# EAGLE design Attiny MCU Module (EAGLE 9.0.0)
Pinboard II CPU Module Atmel Attiny xx
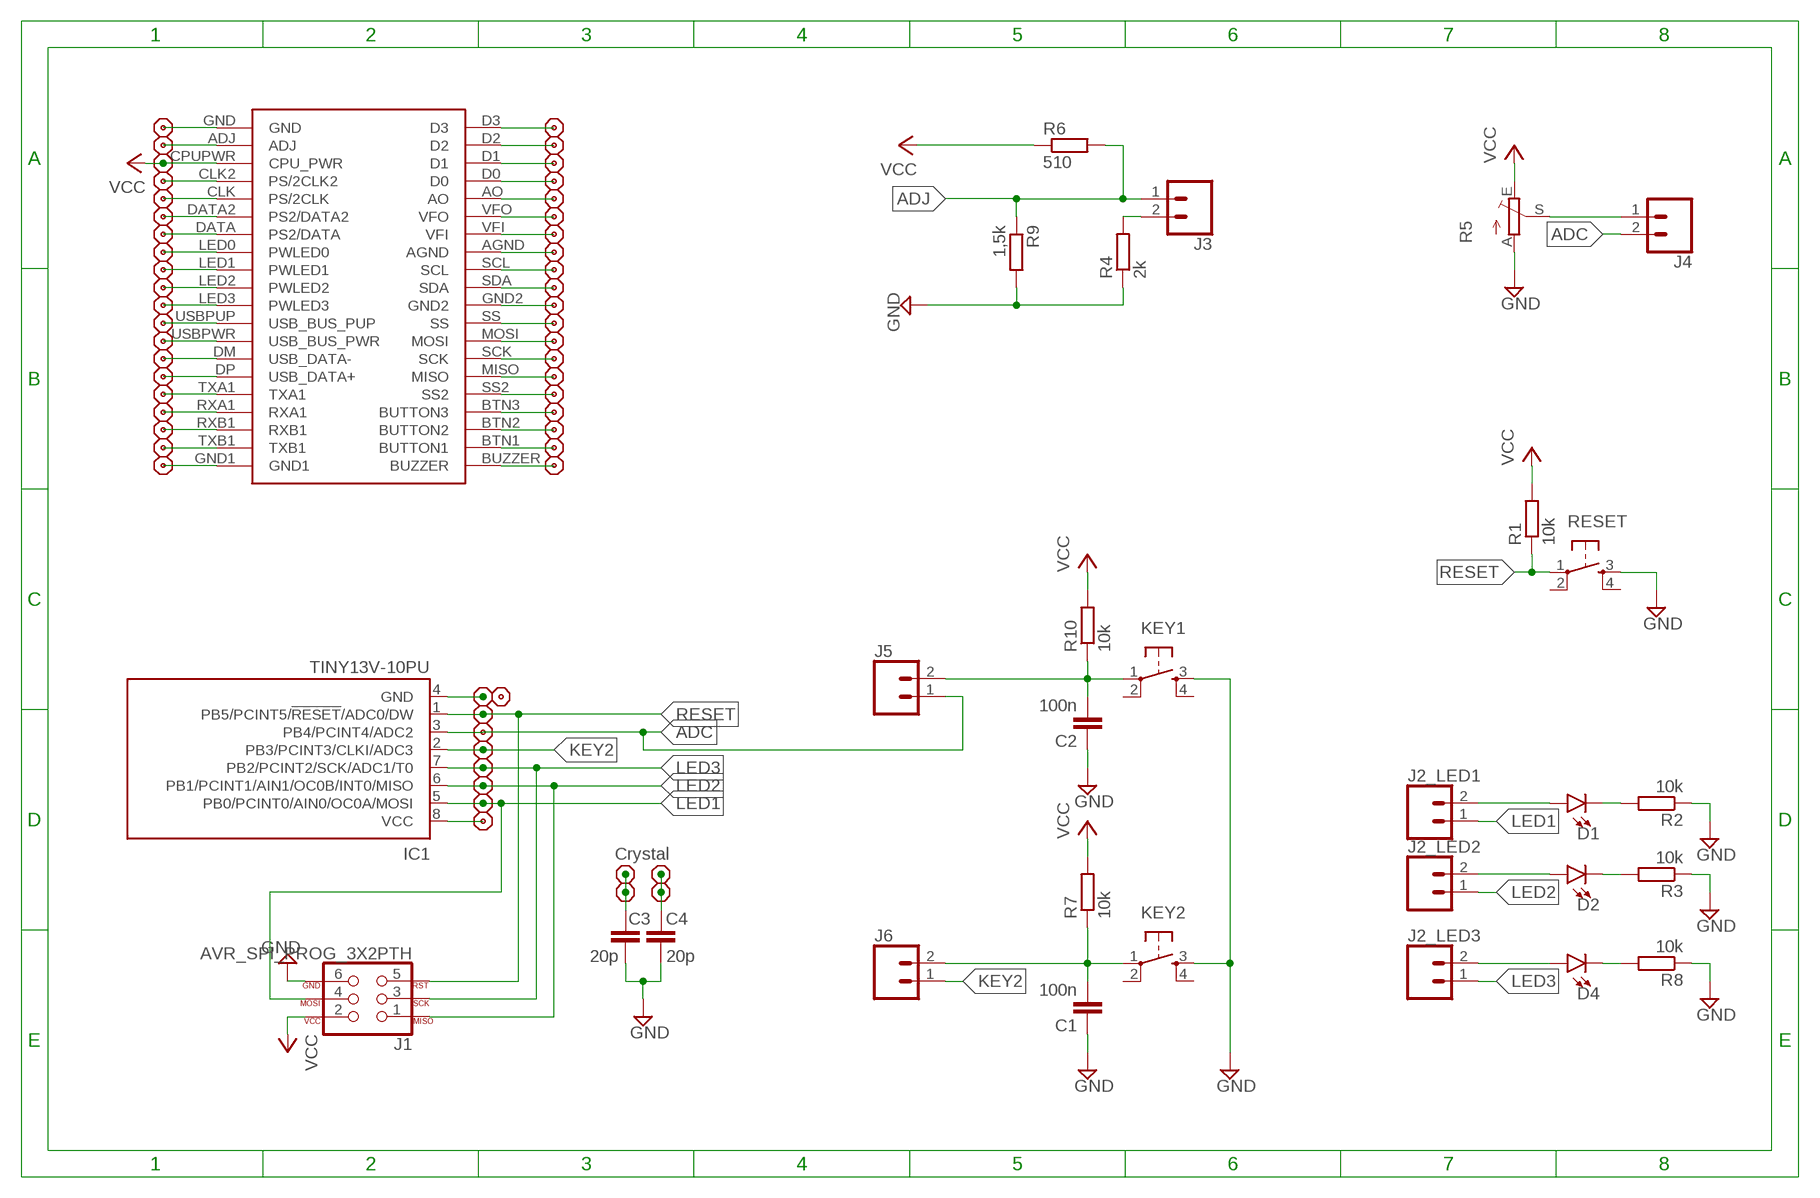
[diagram p0: schematic, sheet 1]

## Parts
C1  100n  C-EUC1206  [C1206]
C2  100n  C-EUC1206  [C1206]
C3  20p  C-EUC1206  [C1206]
C4  20p  C-EUC1206  [C1206]
D1  LED1206  [LED-1206]
D2  LED1206  [LED-1206]
D4  LED1206  [LED-1206]
IC1  TINY13V-10PU  [DIL08]
J1  AVR_SPI_PROG_3X2PTH  [2X3]
J2_LED1  CONN_02  [1X02]
J2_LED2  CONN_02  [1X02]
J2_LED3  CONN_02  [1X02]
J3  CONN_02  [1X02]
J4  CONN_02  [1X02]
J5  CONN_02  [1X02]
J6  CONN_02  [1X02]
JP1  PINHD-1X1PIN  [1X01]
JP2  PINHD-1X1PIN  [1X01]
JP3  PINHD-1X1PIN  [1X01]
JP4  PINHD-1X1PIN  [1X01]
JP5  PINHD-1X1PIN  [1X01]
JP6  PINHD-1X1PIN  [1X01]
JP7  PINHD-1X1PIN  [1X01]
JP8  PINHD-1X1PIN  [1X01]
JP9  PINHD-1X1PIN  [1X01]
JP10  PINHD-1X1PIN  [1X01]
JP11  PINHD-1X1PIN  [1X01]
JP12  PINHD-1X1PIN  [1X01]
JP13  PINHD-1X1PIN  [1X01]
KEY1  TAC_SWITCHPTH  [TACTILE-PTH]
KEY2  TAC_SWITCHPTH  [TACTILE-PTH]
R1  10k  R-EU_M1206  [M1206]
R2  10k  R-EU_M1206  [M1206]
R3  10k  R-EU_M1206  [M1206]
R4  2k  R-EU_M1206  [M1206]
R5  TRIM_EU-B25P  [B25P]
R6  510  R-EU_M1206  [M1206]
R7  10k  R-EU_M1206  [M1206]
R8  10k  R-EU_M1206  [M1206]
R9  1,5k  R-EU_M1206  [M1206]
R10  10k  R-EU_M1206  [M1206]
RESET  TAC_SWITCHPTH  [TACTILE-PTH]
U$1  CPU_CON  [CPU_SHIELD]
U$2  PINHD1X20  [PINHD1X20]
U$3  PINHD1X20  [PINHD1X20]

## Nets
ADC: IC1.3(PB4/PCINT4/ADC2) J4.2 J5.1 JP3.1
ADJ: J3.1 R6.2 R9.1 U$1.ADJ U$3.19
GND: C1.1 C2.1 C3.1 C4.1 IC1.4(GND) J1.6 JP1.1 KEY1.3 KEY2.3 R2.1 R3.1 R4.1 R5.A R8.1 R9.2 RESET.3 U$1.GND U$1.GND1 U$1.GND2 U$2.10 U$3.1 U$3.20
KEY2: IC1.2(PB3/PCINT3/CLKI/ADC3) J6.1 JP4.1
LED1: IC1.5(PB0/PCINT0/AIN0/OC0A/MOSI) J1.4 J2_LED1.1 JP7.1
LED2: IC1.6(PB1/PCINT1/AIN1/OC0B/INT0/MISO) J1.1 J2_LED2.1 JP6.1
LED3: IC1.7(PB2/PCINT2/SCK/ADC1/T0) J1.3 J2_LED3.1 JP5.1
N$1: C3.2 JP10.1 JP11.1
N$2: D1.A J2_LED1.2
N$3: D1.C R2.2
N$5: D2.C R3.2
N$6: D2.A J2_LED2.2
N$7: D4.A J2_LED3.2
N$8: C4.2 JP9.1 JP12.1
N$9: D4.C R8.2
N$10: U$1.AO U$2.16
N$13: J3.2 R4.2
N$14: U$1.BUZZER U$2.1
N$15: U$1.BTN1(BUTTON1) U$2.2
N$16: U$1.BTN2(BUTTON2) U$2.3
N$17: U$1.BTN3(BUTTON3) U$2.4
N$18: U$1.SS2 U$2.5
N$19: U$1.MISO U$2.6
N$20: U$1.SCK U$2.7
N$21: U$1.MOSI U$2.8
N$22: U$1.SS U$2.9
N$24: U$1.SDA U$2.11
N$25: U$1.SCL U$2.12
N$26: U$1.AGND U$2.13
N$27: U$1.VFI U$2.14
N$28: U$1.VFO U$2.15
N$30: U$1.D0 U$2.17
N$31: U$1.D1 U$2.18
N$32: U$1.D2 U$2.19
N$33: U$1.D3 U$2.20
N$35: U$1.TXB1 U$3.2
N$36: U$1.RXB1 U$3.3
N$37: U$1.RXA1 U$3.4
N$38: U$1.TXA1 U$3.5
N$39: U$1.DP(USB_DATA+) U$3.6
N$40: U$1.DM(USB_DATA-) U$3.7
N$41: U$1.USBPWR(USB_BUS_PWR) U$3.8
N$42: U$1.USBPUP(USB_BUS_PUP) U$3.9
N$43: U$1.LED3(PWLED3) U$3.10
N$44: U$1.LED2(PWLED2) U$3.11
N$45: U$1.LED1(PWLED1) U$3.12
N$46: U$1.LED0(PWLED0) U$3.13
N$47: U$1.DATA(PS2/DATA) U$3.14
N$48: U$1.DATA2(PS2/DATA2) U$3.15
N$49: U$1.CLK(PS/2CLK) U$3.16
N$50: U$1.CLK2(PS/2CLK2) U$3.17
N$54: J4.1 R5.S
N$55: C1.2 J6.2 KEY2.1 R7.1
N$56: C2.2 J5.2 KEY1.1 R10.1
RESET: IC1.1(PB5/PCINT5/!RESET!/ADC0/DW) J1.5 JP2.1 R1.1 RESET.1
VCC: IC1.8(VCC) J1.2 JP8.1 R1.2 R5.E R6.1 R7.2 R10.2 U$1.CPUPWR(CPU_PWR) U$3.18
Unconnected: JP13.1 KEY1.2 KEY1.4 KEY2.2 KEY2.4 RESET.2 RESET.4

## Notes on the sheet
- Crystal

## Library data of the parts
C1-C4 = rcl:C-EU: CAPACITOR, European symbol; SPICEPREFIX: C
D1 D2 D4 = SparkFun-LED:LED: LED (Generic) Standard schematic elements and footprints for 5mm, 3mm, 1206, and 0603 sized LEDs. Generic LEDs with no color specified.
IC1 = atmel:TINY13: 8-bit AVR Microcontroller with 1K Bytes In-System Programmable Flash Source: http://www.atmel.com/dyn/resources/prod_documents/2535S.pdf; MPN: ATTINY13V-10PU; OC_FARNELL: 9171576; OC_NEWARK: 96K6523
J1 = SparkFun-Connectors:AVR_SPI_PROG_3X2: AVR ISP 6 Pin This is the reduced ISP connector for AVR programming. Common on Arduino. This footprint will take up less PCB space and can be used with a 10-pin to 6-pin adapter such as SKU: BOB-08508 **Special note about "TEST_POINT" package. The stop mask is on the top side, so if you want your programming test points to be on the bottom of your board, make sure to place this package on the bottom side of the board. This also ensure that the orientation to program from the bottom side will be correct. SparkFun Products: SparkFun ISP Pogo Adapter <https://www.sparkfun.com/products/11591> - NS Tiny AVR Programmer <https://www.sparkfun.com/products/11801> -PTH
J2_LED1-J2_LED3 J3-J6 = SparkFun-Connectors:CONN_02: Multi connection point. Often used as Generic Header-pin footprint for 0.1 inch spaced/style header connections On any of the 0.1 inch spaced packages, you can populate with these: Break Away Headers - Straight <https://www.sparkfun.com/products/116> (PRT-00116) Break Away Male Headers - Right Angle <https://www.sparkfun.com/products/553> (PRT-00553) Female Headers <https://www.sparkfun.com/products/115> (PRT-00115) Break Away Headers - Machine Pin <https://www.sparkfun.com/products/117> (PRT-00117) Break Away Female Headers - Swiss Machine Pin <https://www.sparkfun.com/products/743> (PRT-00743) For SCREWTERMINALS and SPRING TERMINALS visit here: Screw Terimnals on SparkFun.com <https://www.sparkfun.com/search/results?term=Screw+Terminals> (5mm/3.5mm/2.54mm spacing) This device is also useful as a general connection point to wire up your design to another part of your project. Our various solder wires solder well into these plated through hole pads. Hook-Up Wire - Assortment (Stranded, 22 AWG) <https://www.sparkfun.com/products/11375> (PRT-11375) Hook-Up Wire - Assortment (Solid Core, 22 AWG) <https://www.sparkfun.com/products/11367> (PRT-11367) View the entire wire category on our website here <https://www.sparkfun.com/categories/141> Special notes: Molex polarized connector foot print use with: PRT-08233 with associated crimp pins and housings. 2.54_SCREWTERM for use with PRT-10571. 3.5mm Screw Terminal footprints for PRT-08084 5mm Screw Terminal footprints for use with PRT-08432
JP1-JP13 = UserLibs-Pinboard:PINHD-1X1: PIN HEADER
KEY1 KEY2 RESET = SparkFun-Retired:TAC_SWITCH: Momentary Switch Button commonly used for reset or general input. Spark Fun Electronics SKU : COM-00097 SMT- SWCH-08247
R1-R4 R6-R10 = rcl:R-EU_: RESISTOR, European symbol
R5 = pot:TRIM_EU-: POTENTIOMETER
U$1 = UserLibs-Pinboard:CPU_CON
U$2 U$3 = UserLibs-Pinboard:PINHD1X20: Pinheader 19pin for PinBoard II

## Board
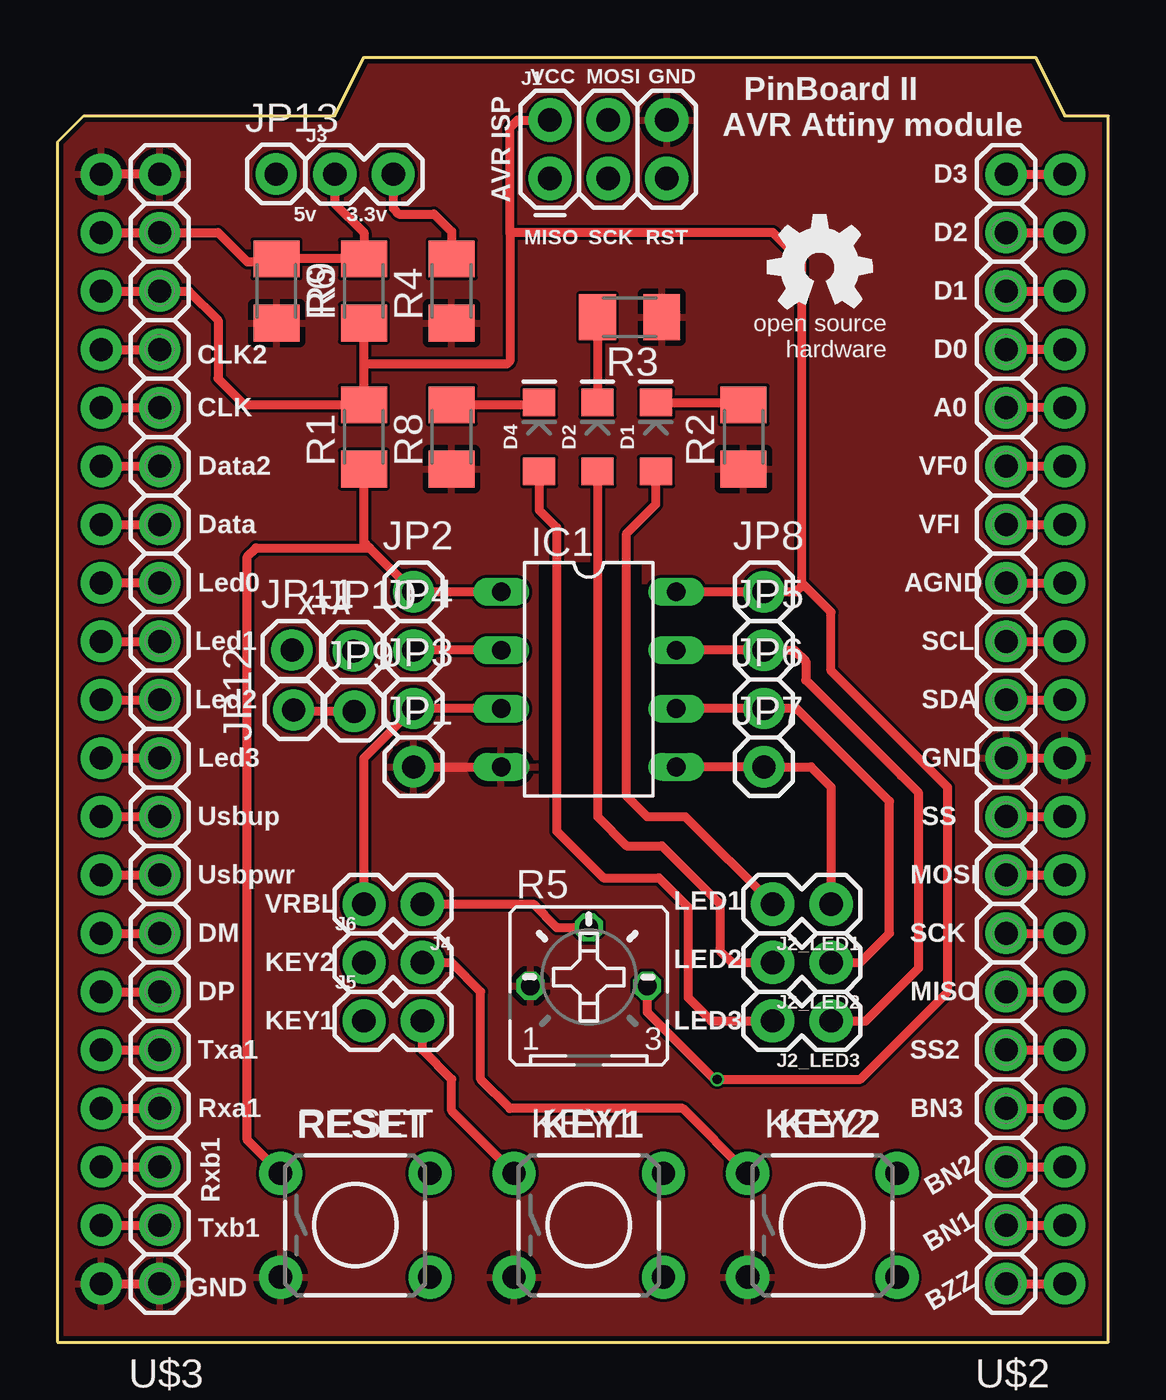
[diagram p1: board, top side]
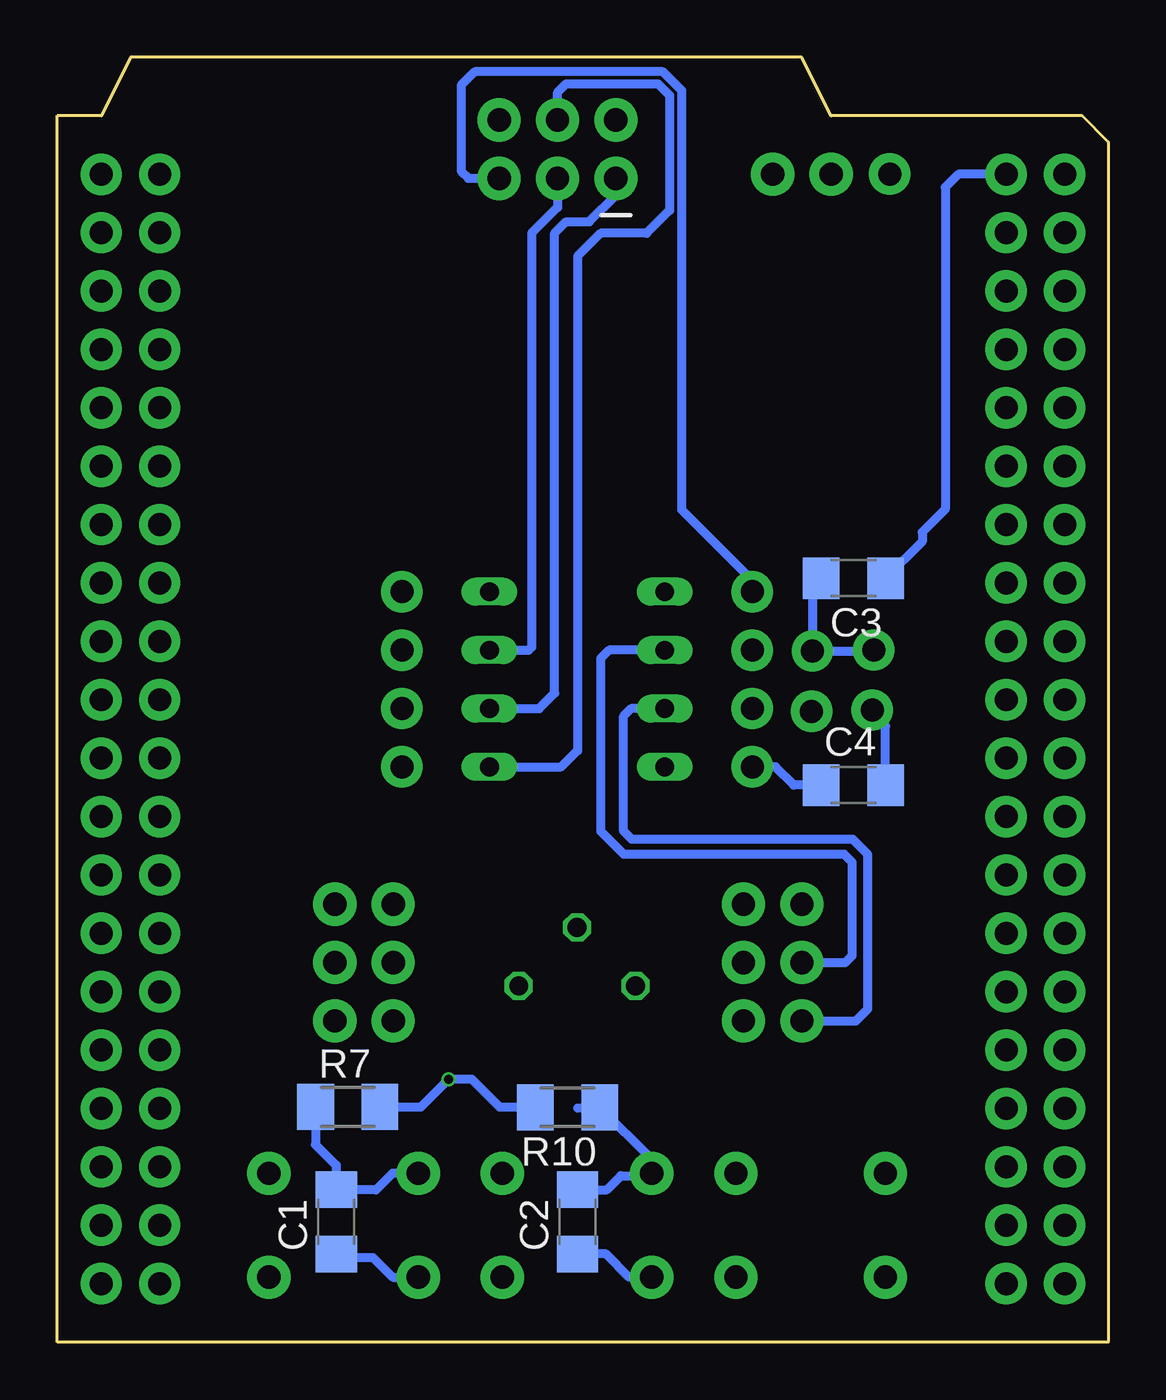
[diagram p2: board, bottom side, seen from below]

Size 45.72 x 55.88 mm. Coordinates in mm from the lower left corner, seen from the top.
Copper layers (1*16): Top 0.035559375mm / dielectric 1.6mm / Bottom 0.035559375mm
Design rules "jlcpcb2layer": minimum track width 5mil, minimum drill 12mil, track to track 5mil, track to pad 5mil, pad to pad 5mil, via to via 5mil, smd to smd 5mil, copper to edge 8mil, drill to drill 6mil, minimum pad ring 5mil, minimum via ring 3mil, stop-mask expansion 2.5mil, vias tented up to drill 0mil, thermal gap 10mil
tRestrict: area 21,23.7 to 25.4,33.9; area 27.1,13.3 to 27.2,18.9

### Footprints (pad centres in the part's own frame; a part is rotated, then mirrored left to right if it is on the bottom)
C1206 = smd 1.6 x 1.8: 1 -1.4,0; 2 1.4,0
LED-1206 = smd 1.2 x 1.4: A -1.5,0; C 1.5,0
DIL08 = drill 0.813 long: 1 -3.81,-3.81; 2 -1.27,-3.81; 3 1.27,-3.81; 4 3.81,-3.81; 5 3.81,3.81; 6 1.27,3.81; 7 -1.27,3.81; 8 -3.81,3.81
2X3 = drill 1.016 pad 1.88: 1 0,0; 2 0,2.54; 3 2.54,0; 4 2.54,2.54; 5 5.08,0; 6 5.08,2.54
1X02 = drill 1.016 pad 1.88: 1 0,0; 2 2.54,0
1X01 = drill 1 pad 1.8: 1 0,0
TACTILE-PTH = drill 1.016 pad 1.88: 1 -3.251,2.261; 2 3.251,2.261; 3 -3.251,-2.261; 4 3.251,-2.261
M1206 = smd 1.6 x 2: 1 -1.4,0; 2 1.4,0
B25P = drill 0.813 octagon: A -2.54,0; E 2.54,0; S 0,2.54
CPU_SHIELD = drill 1 pad 1.8: ADJ 0,-2.54; AGND 41.91,-17.78; AO 41.91,-10.16; BTN1 41.91,-45.72; BTN2 41.91,-43.18; BTN3 41.91,-40.64; BUZZER 41.91,-48.26; CLK 0,-10.16; CLK2 0,-7.62; CPUPWR 0,-5.08; D0 41.91,-7.62; D1 41.91,-5.08; D2 41.91,-2.54; D3 41.91,0; DATA 0,-15.24; DATA2 0,-12.7; DM 0,-33.02; DP 0,-35.56; GND 0,0; GND1 0,-48.26; GND2 41.91,-25.4; LED0 0,-17.78; LED1 0,-20.32; LED2 0,-22.86; LED3 0,-25.4; MISO 41.91,-35.56; MOSI 41.91,-30.48; RXA1 0,-40.64; RXB1 0,-43.18; SCK 41.91,-33.02; SCL 41.91,-20.32; SDA 41.91,-22.86; SS 41.91,-27.94; SS2 41.91,-38.1; TXA1 0,-38.1; TXB1 0,-45.72; USBPUP 0,-27.94; USBPWR 0,-30.48; VFI 41.91,-15.24; VFO 41.91,-12.7
PINHD1X20 = drill 1 pad 1.8: 1 0,0; 2 0,2.54; 3 0,5.08; 4 0,7.62; 5 0,10.16; 6 0,12.7; 7 0,15.24; 8 0,17.78; 9 0,20.32; 10 0,22.86; 11 0,25.4; 12 0,27.94; 13 0,30.48; 14 0,33.02; 15 0,35.56; 16 0,38.1; 17 0,40.64; 18 0,43.18; 19 0,45.72; 20 0,48.26

### Placement (x,y rotation side)
C1  33.59,5.23 90 bottom
C2  23.09,5.23 90 bottom
C3  11.1,33.23 180 bottom
C4  11.1,24.23 0 bottom
D1  26.04,39.37 90 top
D2  23.49,39.37 90 top
D4  20.95,39.37 90 top
IC1  23.11,28.83 270 top
J1  21.42,50.62 0 top
J2_LED1  33.66,19.05 180 top
J2_LED2  33.66,16.51 180 top
J2_LED3  33.66,13.97 180 top
J3  12.07,50.8 0 top
J4  15.88,19.05 180 top
J5  13.34,13.97 0 top
J6  13.34,16.51 0 top
JP1  15.49,25.02 0 top
JP2  15.49,32.64 0 top
JP3  15.49,27.56 0 top
JP4  15.49,30.1 0 top
JP5  30.73,30.1 0 top
JP6  30.73,27.56 0 top
JP7  30.73,25.02 0 top
JP8  30.73,32.64 0 top
JP9  12.91,27.43 0 top
JP10  12.88,30.06 0 top
JP11  10.21,30.1 0 top
JP12  10.28,27.49 90 top
JP13  9.51,50.81 0 top
KEY1  23.11,5.08 0 top
KEY2  33.27,5.08 0 top
R1  13.34,39.37 90 top
R2  29.84,39.37 90 top
R3  24.89,44.58 180 top
R4  17.14,45.72 90 top
R5  23.11,15.49 0 top
R6  13.34,45.72 90 top
R7  33.09,10.23 0 bottom
R8  17.14,39.37 90 top
R9  9.53,45.72 270 top
R10  23.53,10.22 180 bottom
RESET  12.95,5.08 0 top
U$1  1.91,50.8 0 top
U$2  41.27,2.54 0 top
U$3  4.44,2.54 0 top
U$4  [OSHW_5MM]  33.16,46.76 0 top

### Tracks (layer width: path | path; a pad name or v marks a point on that pad's centre or on a via)
ADC
  Top 0.4: IC1.3 JP3.1 13.34,25.4 J4.2
  Bottom 0.4: J5.1 10.99,13.97 10.46,14.49 10.46,21.21 11.12,21.87 20.73,21.87 21.09,22.23 21.09,27.23 20.77,27.56 IC1.3
ADJ
  Top 0.4: J3.1 12.07,49.53 13.34,48.26 R6.2 R9.1 9.4,46.99 8.26,46.99 6.99,48.26 U$3.19 U$1.ADJ
GND
  Top 0.4: JP1.1 IC1.4 | U$2.10 U$1.GND2 | U$1.GND1 U$3.1 | U$3.20 U$1.GND
  Bottom 0.4: KEY1.3 20.85,2.82 21.86,3.83 C2.1 | C1.1 33.45,3.68 32,3.68 31.14,2.82 KEY2.3 | C4.1 13.69,24.23 14.48,25.02 JP1.1 | U$3.20 6.52,50.8 7.09,50.23 7.09,36.23 8.1,35.23 8.1,34.83 C3.1
  pour Top: 0,52.2 0,0 45.72,0 45.72,53.34 43.81,53.34 42.55,55.75 42.16,55.88 13.34,55.88 12.07,53.34 1.14,53.34
KEY2
  Top 0.4: IC1.2 JP4.1
  Bottom 0.152: 13.12,16.73 J6.1
  Bottom 0.4: J6.1 11.44,16.51 11.14,16.81 11.14,20.85 11.51,21.22 21.09,21.22 22.09,22.23 22.09,29.73 21.73,30.1 IC1.2
LED1
  Top 0.4: IC1.5 JP7.1 32.78,25.02 33.66,24.14 J2_LED1.1
  Bottom 0.4: IC1.5 23.81,25.02 23.09,25.73 23.09,47.23 22.09,48.23 20.09,48.23 19.09,49.23 19.09,54.23 19.59,54.73 23.59,54.73 23.96,54.36 J1.4
LED2
  Top 0.4: IC1.6 JP6.1 32.16,27.56 36.2,23.52 36.2,17.78 34.92,16.51 J2_LED2.1
  Bottom 0.4: IC1.6 24.77,27.56 24.09,28.23 24.09,48.23 23.59,48.73 22.59,48.73 21.42,49.9 J1.1
LED3
  Top 0.4: JP5.1 IC1.7 | 30.75,30.11 JP5.1 | JP5.1 32.07,30.1 32.55,29.62 32.55,28.79 36.7,24.64 | 36.7,24.64 36.7,24.62 | 36.7,24.64 37.46,23.88 37.46,16.27 35.17,13.97 J2_LED3.1
  Bottom 0.4: IC1.7 25.23,30.1 25.09,30.23 25.09,48.23 23.96,49.36 J1.3
N$1
  Bottom 0.4: JP11.1 10.25,30.06 JP10.1 12.88,32.85 C3.2
N$2
  Top 0.4: J2_LED1.2 27.3,22.86 25.65,22.86 24.77,23.75 24.77,35.18 26.04,36.45 D1.A
N$3
  Top 0.4: D1.C 29.74,40.87 R2.2
N$5
  Top 0.4: R3.2 D2.C
N$6
  Top 0.4: J2_LED2.2 29.34,16.51 28.83,17.02 28.83,19.05 26.29,21.59 24.77,21.59 23.49,22.86 D2.A
N$7
  Top 0.4: J2_LED3.2 28.45,13.97 27.43,14.99 27.43,18.92 26.16,20.19 23.75,20.19 21.72,22.22 21.72,35.43 20.95,36.2 D4.A
N$8
  Top 0.4: JP9.1 10.34,27.43 JP12.1
  Bottom 0.4: JP12.1 10.34,27.43 9.7,26.79 C4.2
N$9
  Top 0.4: R8.2 20.86,40.77 D4.C
N$10
  Top 0.4: U$1.AO U$2.16
N$13
  Top 0.4: J3.2 14.61,49.31 14.85,49.07 16.38,49.07 17.14,48.31 R4.2
N$14
  Top 0.4: U$2.1 U$1.BUZZER
N$15
  Top 0.4: U$2.2 U$1.BTN1
N$16
  Top 0.4: U$2.3 U$1.BTN2
N$17
  Top 0.4: U$2.4 U$1.BTN3
N$18
  Top 0.4: U$2.5 U$1.SS2
N$19
  Top 0.4: U$2.6 U$1.MISO
N$20
  Top 0.4: U$2.7 U$1.SCK
N$21
  Top 0.4: U$2.8 U$1.MOSI
N$22
  Top 0.4: U$2.9 U$1.SS
N$24
  Top 0.4: U$2.11 U$1.SDA
N$25
  Top 0.4: U$2.12 U$1.SCL
N$26
  Top 0.4: U$2.13 U$1.AGND
N$27
  Top 0.4: U$2.14 U$1.VFI
N$28
  Top 0.4: U$2.15 U$1.VFO
N$30
  Top 0.4: U$1.D0 U$2.17
N$31
  Top 0.4: U$2.18 U$1.D1
N$32
  Top 0.4: U$2.19 U$1.D2
N$33
  Top 0.4: U$2.20 U$1.D3
N$35
  Top 0.4: U$1.TXB1 U$3.2
N$36
  Top 0.4: U$1.RXB1 U$3.3
N$37
  Top 0.4: U$1.RXA1 U$3.4
N$38
  Top 0.4: U$1.TXA1 U$3.5
N$39
  Top 0.4: U$1.DP U$3.6
N$40
  Top 0.4: U$1.DM U$3.7
N$41
  Top 0.4: U$1.USBPWR U$3.8
N$42
  Top 0.4: U$1.USBPUP U$3.9
N$43
  Top 0.4: U$1.LED3 U$3.10
N$44
  Top 0.4: U$1.LED2 U$3.11
N$45
  Top 0.4: U$1.LED1 U$3.12
N$46
  Top 0.4: U$3.13 U$1.LED0
N$47
  Top 0.4: U$1.DATA U$3.14
N$48
  Top 0.4: U$1.DATA2 U$3.15
N$49
  Top 0.4: U$1.CLK U$3.16
N$50
  Top 0.4: U$1.CLK2 U$3.17
N$54
  Top 0.4: J4.1 20.7,19.05 21.72,18.03 R5.S
N$55
  Top 0.4: J6.2 17.14,16.51 18.41,15.24 18.41,11.43 19.68,10.16 27.2,10.16 KEY2.1
  Bottom 0.4: KEY2.1 31.14,7.34 31.88,6.6 31.9,6.63 C1.2 33.59,7.69 34.49,8.59 R7.1
N$56
  Top 0.4: KEY1.1 17.14,10.06 17.14,11.43 15.88,12.7 J5.2
  Bottom 0.4: C2.2 21.82,6.63 21.21,7.24 19.96,7.24 KEY1.1 19.86,7.95 R10.1 23.09,10.18
RESET
  Top 0.4: IC1.1 JP2.1 13.59,34.54 | 13.59,34.54 13.34,34.8 R1.1 | RESET.1 8.26,8.79 8.26,34.16 8.64,34.54 13.59,34.54
  Bottom 0.4: J1.5 27.84,50.62 28.16,50.94 28.16,54.67 27.57,55.26 19.38,55.26 18.57,54.45 18.57,36.2 15.49,33.13 JP2.1
VCC  (via drill 0.4)
  Top 0.4: R5.E 25.65,14.35 28.57,11.43 v28.7,11.43 34.92,11.43 38.73,15.24 38.73,24.13 33.66,29.21 33.66,31.75 32.45,32.96 | 13.34,42.42 R1.2 8.12,40.77 6.99,41.91 6.99,44.45 5.71,45.72 U$3.18 U$1.CPUPWR | 13.34,42.42 R6.1 | 13.34,42.42 13.46,42.54 19.56,42.54 19.68,42.67 19.68,48.25 | IC1.8 JP8.1 32.13,32.64 32.45,32.96 | 32.45,32.96 32.38,33.02 32.38,46.99 31.12,48.26 19.7,48.26 19.68,48.25 | J1.2 20.02,53.16 19.68,52.82 19.68,48.25
  Bottom 0.4: R7.2 29.9,10.23 v28.7,11.43 27.69,11.43 26.47,10.22 R10.2

### Text on the board
tPlace: VCC | MOSI | GND | PinBoard II | AVR Attiny module | D3 | AVR ISP | 5v | 3.3v | MISO | SCK | RST | D2 | D1 | CLK2 | D0 | CLK | A0 | Data2 | VF0 | Data | VFI | Led0 | XTA | AGND | Led1 | SCL | Led2 | SDA | Led3 | GND | Usbup | SS | Usbpwr | MOSI | VRBL | LED1 | DM | SCK | LED2 | KEY2 | DP | MISO | KEY1 | LED3 | Txa1 | SS2 | Rxa1 | BN3 | RESET | KEY1 | KEY2 | BN2 | Rxb1 | BN1 | Txb1 | GND | BZZ